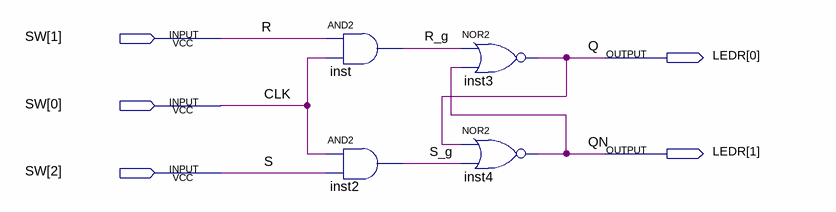
[diagram p0: schematic sheet]
// Quartus schematic rs_latch.bdf as structural Verilog: 4 symbols, 5 pins
module rs_latch (
  input  [2:0] SW,
  output [1:0] LEDR
);

  wire R_g, S_g;

  and inst (R_g, SW[1], SW[0]);
  and inst2 (S_g, SW[0], SW[2]);
  nor inst3 (LEDR[0], R_g, LEDR[1]);
  nor inst4 (LEDR[1], LEDR[0], S_g);

  // Other names for the same wires on the sheet: CLK = SW[0]; Q = LEDR[0]; QN = LEDR[1]; R = SW[1]; S = SW[2]
endmodule
